# EAGLE design PhoenicianClock_d (EAGLE 7.2.0)
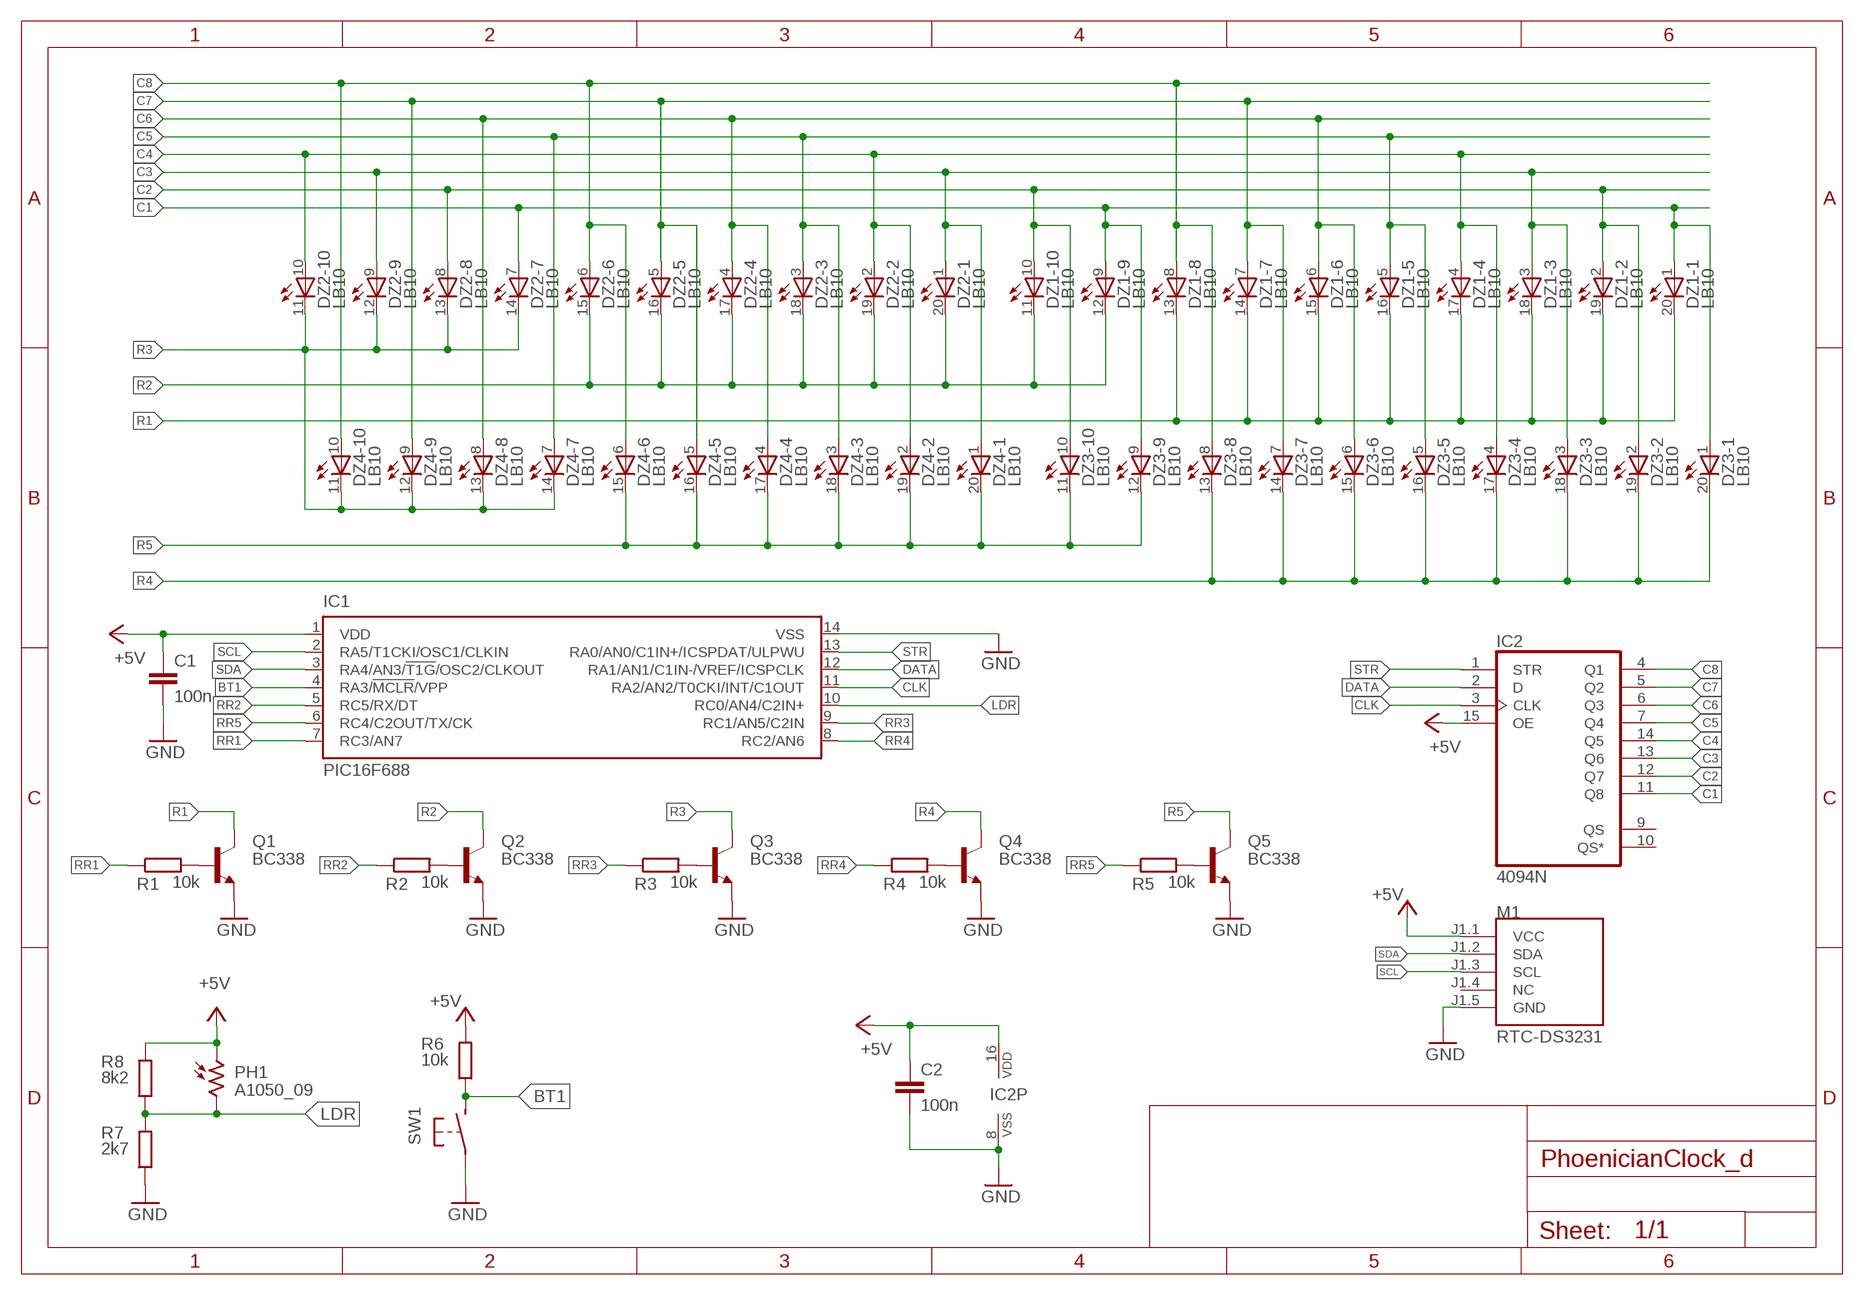
[diagram p0: schematic, sheet 1]

## Parts
C1  100n  C-EU050-024X044  [C050-024X044]
C2  100n  C-EU050-024X044  [C050-024X044]
DZ1  LB10  [LB10]
DZ2  LB10  [LB10]
DZ3  LB10  [LB10]
DZ4  LB10  [LB10]
IC1  PIC16F688  [DIL14]
IC2  4094N  [DIL16]
M1  RTC-DS3231  [RTC-DS3231_SMALL]
PH1  A1050_09  [T0-46-A10XX]
Q1  BC338  [TO92-EBC]
Q2  BC338  [TO92-EBC]
Q3  BC338  [TO92-EBC]
Q4  BC338  [TO92-EBC]
Q5  BC338  [TO92-EBC]
R1  10k  R-EU_0204/5  [0204/5]
R2  10k  R-EU_0204/5  [0204/5]
R3  10k  R-EU_0204/5  [0204/5]
R4  10k  R-EU_0204/5  [0204/5]
R5  10k  R-EU_0204/5  [0204/5]
R6  10k  R-EU_0204/5  [0204/5]
R7  2k7  R-EU_0204/5  [0204/5]
R8  8k2  R-EU_0204/5  [0204/5]
SW1  MINISPDT  [2PST_MINI]

## Nets
+5V: C1.1 C2.1 IC1.1(VDD) IC2.15(OE) IC2.16(VDD) M1.J1.1(VCC) PH1.1 R6.2 R8.2
BT1: IC1.4(RA3/!MCLR!/VPP) R6.1 SW1.P$2(S)
C1: DZ1.1(-1:A) DZ1.9(-9:A) DZ2.7(-7:A) DZ3.1(-1:A) DZ3.9(-9:A) IC2.11(Q8)
C2: DZ1.2(-2:A) DZ1.10(-10:A) DZ2.8(-8:A) DZ3.2(-2:A) DZ3.10(-10:A) IC2.12(Q7)
C3: DZ1.3(-3:A) DZ2.1(-1:A) DZ2.9(-9:A) DZ3.3(-3:A) DZ4.1(-1:A) IC2.13(Q6)
C4: DZ1.4(-4:A) DZ2.2(-2:A) DZ2.10(-10:A) DZ3.4(-4:A) DZ4.2(-2:A) IC2.14(Q5)
C5: DZ1.5(-5:A) DZ2.3(-3:A) DZ3.5(-5:A) DZ4.3(-3:A) DZ4.7(-7:A) IC2.7(Q4)
C6: DZ1.6(-6:A) DZ2.4(-4:A) DZ3.6(-6:A) DZ4.4(-4:A) DZ4.8(-8:A) IC2.6(Q3)
C7: DZ1.7(-7:A) DZ2.5(-5:A) DZ3.7(-7:A) DZ4.5(-5:A) DZ4.9(-9:A) IC2.5(Q2)
C8: DZ1.8(-8:A) DZ2.6(-6:A) DZ3.8(-8:A) DZ4.6(-6:A) DZ4.10(-10:A) IC2.4(Q1)
CLK: IC1.11(RA2/AN2/T0CKI/INT/C1OUT) IC2.3(CLK)
DATA: IC1.12(RA1/AN1/C1IN-/VREF/ICSPCLK) IC2.2(D)
GND: C1.2 C2.2 IC1.14(VSS) IC2.8(VSS) M1.J1.5(GND) Q1.E Q2.E Q3.E Q4.E Q5.E R7.1 SW1.P$1(P)
LDR: IC1.10(RC0/AN4/C2IN+) PH1.2 R7.2 R8.1
N$3: Q1.B R1.2
N$4: Q2.B R2.2
N$5: Q3.B R3.2
N$6: Q4.B R4.2
N$7: Q5.B R5.2
R1: DZ1.13(-8:C) DZ1.14(-7:C) DZ1.15(-6:C) DZ1.16(-5:C) DZ1.17(-4:C) DZ1.18(-3:C) DZ1.19(-2:C) DZ1.20(-1:C) Q1.C
R2: DZ1.11(-10:C) DZ1.12(-9:C) DZ2.15(-6:C) DZ2.16(-5:C) DZ2.17(-4:C) DZ2.18(-3:C) DZ2.19(-2:C) DZ2.20(-1:C) Q2.C
R3: DZ2.11(-10:C) DZ2.12(-9:C) DZ2.13(-8:C) DZ2.14(-7:C) DZ4.11(-10:C) DZ4.12(-9:C) DZ4.13(-8:C) DZ4.14(-7:C) Q3.C
R4: DZ3.13(-8:C) DZ3.14(-7:C) DZ3.15(-6:C) DZ3.16(-5:C) DZ3.17(-4:C) DZ3.18(-3:C) DZ3.19(-2:C) DZ3.20(-1:C) Q4.C
R5: DZ3.11(-10:C) DZ3.12(-9:C) DZ4.15(-6:C) DZ4.16(-5:C) DZ4.17(-4:C) DZ4.18(-3:C) DZ4.19(-2:C) DZ4.20(-1:C) Q5.C
RR1: IC1.7(RC3/AN7) R1.1
RR2: IC1.5(RC5/RX/DT) R2.1
RR3: IC1.9(RC1/AN5/C2IN) R3.1
RR4: IC1.8(RC2/AN6) R4.1
RR5: IC1.6(RC4/C2OUT/TX/CK) R5.1
SCL: IC1.2(RA5/T1CKI/OSC1/CLKIN) M1.J1.3(SCL)
SDA: IC1.3(RA4/AN3/!T1G!/OSC2/CLKOUT) M1.J1.2(SDA)
STR: IC1.13(RA0/AN0/C1IN+/ICSPDAT/ULPWU) IC2.1(STR)
Unconnected: IC2.9(QS) IC2.10(QS*) M1.J1.4(NC)

## Library data of the parts
C1 C2 = rcl:C-EU: CAPACITOR, European symbol
DZ1-DZ4 = led:LB10: LED BLOCK 10-LED bar graph, DIL, Siemens
IC1 = microchip:PIC16F68*
IC2 = 40xx:4094: 8-stage SHIFT/STORE REGISTER, tri-state
M1 = RTC:RTC-DS3231
PH1 = photo-elements:A10: Sensor Robust Light Sensing Applications Outdoor Light Sensing Application Source: http://optoelectronics.perkinelmer.com/content/Datasheets/DTS_PhotocellsA1050.pdf
Q1-Q5 = transistor-npn:BC338*: NPN Transistor
R1-R8 = rcl:R-EU_: RESISTOR, European symbol
SW1 = tactile:MINISPDT

## Board
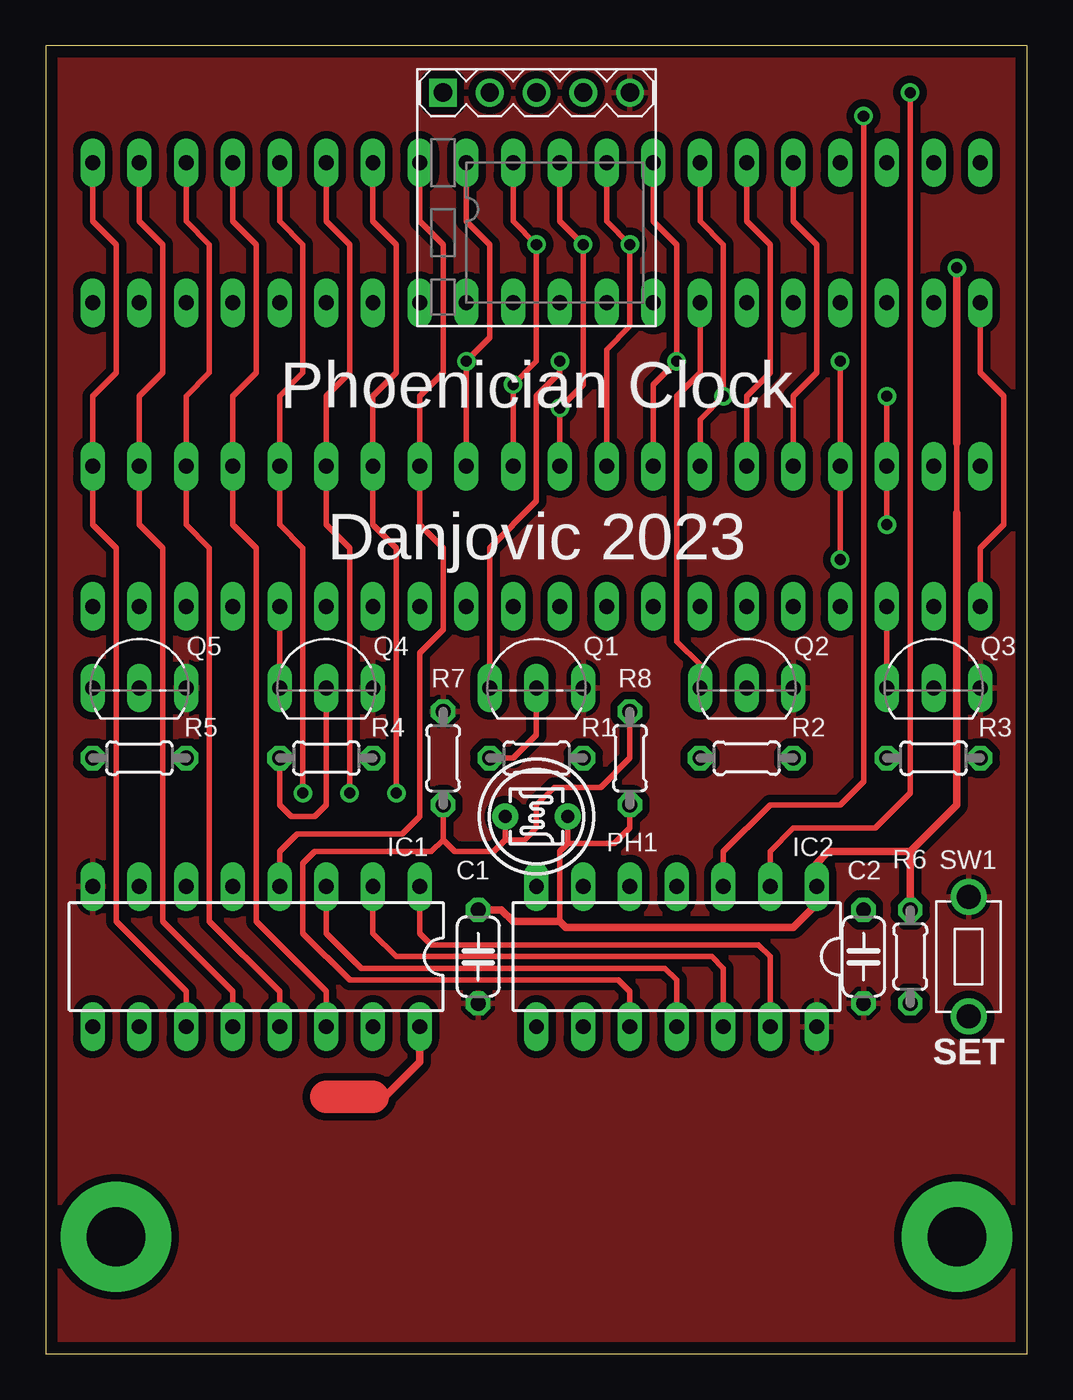
[diagram p1: board, top side]
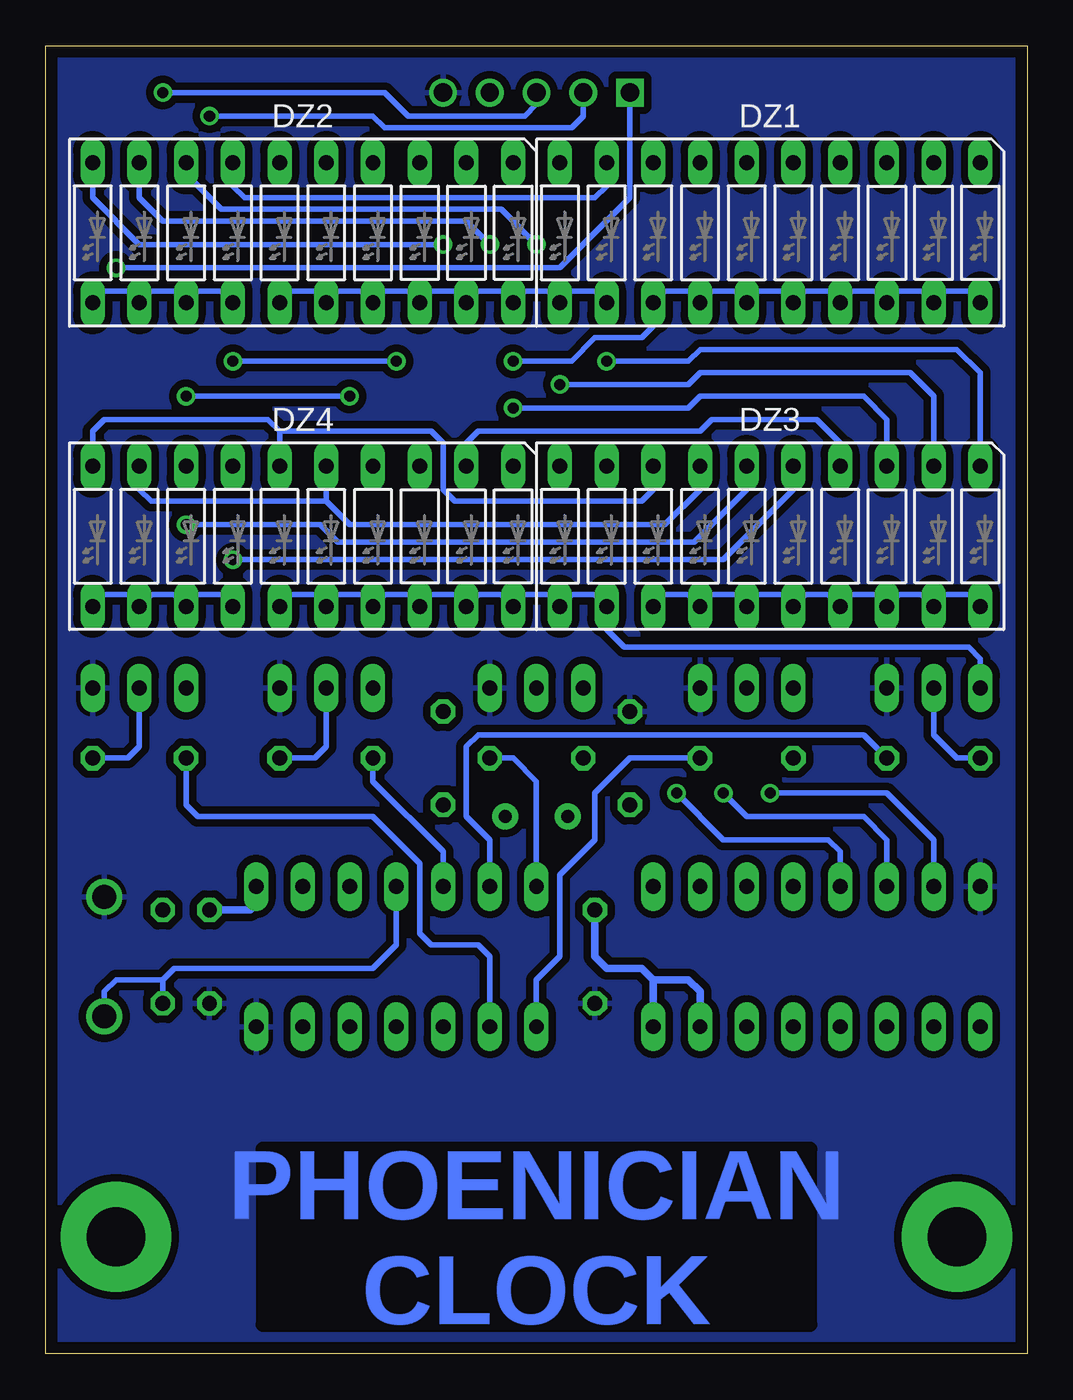
[diagram p2: board, bottom side, seen from below]

Size 53.34 x 71.12 mm. Coordinates in mm from the lower left corner, seen from the top.
Outline: 0,0 53.34,0 53.34,71.12 0,71.12 0,0
Copper layers (1*16): Top 0.035mm / dielectric 1.5mm / Bottom 0.035mm
Design rules "default *": minimum track width 10mil, minimum drill 24mil, track to track 8mil, track to pad 8mil, pad to pad 8mil, via to via 8mil, smd to smd 8mil, copper to edge 25mil, drill to drill 8mil, minimum pad ring 10mil, minimum via ring 8mil, stop-mask expansion 4mil, vias tented up to drill 27mil, thermal gap 10mil

### Footprints (pad centres in the part's own frame; a part is rotated, then mirrored left to right if it is on the bottom)
C050-024X044 = drill 0.813 octagon: 1 -2.54,0; 2 2.54,0
LB10 = drill 0.813 long: 1 -11.43,-3.81; 2 -8.89,-3.81; 3 -6.35,-3.81; 4 -3.81,-3.81; 5 -1.27,-3.81; 6 1.27,-3.81; 7 3.81,-3.81; 8 6.35,-3.81; 9 8.89,-3.81; 10 11.43,-3.81; 11 11.43,3.81; 12 8.89,3.81; 13 6.35,3.81; 14 3.81,3.81; 15 1.27,3.81; 16 -1.27,3.81; 17 -3.81,3.81; 18 -6.35,3.81; 19 -8.89,3.81; 20 -11.43,3.81
DIL14 = drill 0.813 long: 1 -7.62,-3.81; 2 -5.08,-3.81; 3 -2.54,-3.81; 4 0,-3.81; 5 2.54,-3.81; 6 5.08,-3.81; 7 7.62,-3.81; 8 7.62,3.81; 9 5.08,3.81; 10 2.54,3.81; 11 0,3.81; 12 -2.54,3.81; 13 -5.08,3.81; 14 -7.62,3.81
DIL16 = drill 0.813 long: 1 -8.89,-3.81; 2 -6.35,-3.81; 3 -3.81,-3.81; 4 -1.27,-3.81; 5 1.27,-3.81; 6 3.81,-3.81; 7 6.35,-3.81; 8 8.89,-3.81; 9 8.89,3.81; 10 6.35,3.81; 11 3.81,3.81; 12 1.27,3.81; 13 -1.27,3.81; 14 -3.81,3.81; 15 -6.35,3.81; 16 -8.89,3.81
RTC-DS3231_SMALL = drill 1 square: J1.1 -5.08,6.35 | drill 1: J1.2 -2.54,6.35; J1.3 0,6.35; J1.4 2.54,6.35; J1.5 5.08,6.35
T0-46-A10XX = drill 0.7 pad 1.4: 1 -1.7,0; 2 1.7,0
TO92-EBC = drill 0.813 long: B 0,-1.27; C -2.54,-1.27; E 2.54,-1.27
0204/5 = drill 0.813 octagon: 1 -2.54,0; 2 2.54,0
2PST_MINI = drill 1.3: P$1 0,3.25; P$2 0,-3.25

### Placement (x,y rotation side)
C1  23.5,21.59 270 top
C2  44.45,21.59 270 top
DZ1  13.97,60.96 180 bottom
DZ2  39.37,60.96 180 bottom
DZ3  13.97,44.45 180 bottom
DZ4  39.37,44.45 180 bottom
IC1  34.29,21.59 180 top
IC2  11.43,21.59 180 top
M1  26.67,62.23 0 top
PH1  26.67,29.21 180 top
Q1  26.67,37.47 0 top
Q2  38.1,37.47 0 top
Q3  48.26,37.47 0 top
Q4  15.24,37.47 0 top
Q5  5.08,37.47 0 top
R1  26.67,32.38 180 top
R2  38.1,32.38 0 top
R3  48.26,32.38 0 top
R4  15.24,32.38 180 top
R5  5.08,32.38 180 top
R6  46.99,21.59 90 top
R7  21.59,32.38 270 top
R8  31.75,32.38 270 top
SW1  50.16,21.59 0 top

### Tracks (layer width: path | path; a pad name or v marks a point on that pad's centre or on a via)
+5V  (via drill 0.6)
  Top 0.305: 49.53,45.72 49.53,49.53 | PH1.1 28.37,27.73 | 28.37,27.73 27.94,27.3 27.94,23.5 | R8.2 31.75,28.57 30.91,27.73 28.37,27.73
  Top 0.406: C1.1 24.77,24.13 25.4,23.5 27.94,23.5 28.26,23.18 40.64,23.18 41.91,24.45 IC1.1 41.91,26.67 42.55,27.3 46.99,27.3 | IC2.16 20.32,15.88 18.41,13.97 17.78,13.97 | 46.99,27.3 49.53,29.84 49.53,45.72 | R6.2 46.99,27.3 | 49.53,49.53 v49.53,59.05
  Top 1.778: 17.78,13.97 15.24,13.97
  Bottom 0.305: M1.J1.1 21.59,62.87 25.4,59.05 v49.53,59.05
  Bottom 0.406: C2.1 42.23,24.13 41.91,24.45 IC1.1 | C1.1 23.5,21.59 22.86,20.95 20.95,20.95 20.32,20.32 | 20.32,20.32 IC2.16 | IC2.15 17.78,19.68 18.41,20.32 20.32,20.32
BT1
  Bottom 0.305: IC1.4 34.29,22.23 35.56,20.95 46.35,20.95 46.99,20.32 | 46.99,20.32 49.53,20.32 50.16,19.68 SW1.P$2 | R6.1 46.99,20.32
C1  (via drill 0.6)
  Top 0.305: DZ1.1 2.54,61.59 3.81,60.33 3.81,53.34 2.54,52.07 DZ3.1 2.54,45.09 3.81,43.81 3.81,23.5 7.62,19.68 IC2.11 | DZ3.9 v22.86,53.98 24.13,55.24 24.13,60.33 22.86,61.59 DZ1.9
  Bottom 0.305: v22.86,53.98 18.41,53.98 17.78,54.61 3.81,54.61 2.54,53.34 DZ3.1 | DZ2.7 43.18,63.5 42.55,62.87 23.5,62.87 22.86,63.5 DZ1.9
C2  (via drill 0.6)
  Top 0.305: DZ1.2 5.08,61.59 6.35,60.33 6.35,53.34 5.08,52.07 DZ3.2 5.08,45.09 6.35,43.81 6.35,23.5 10.16,19.68 IC2.12 | DZ1.10 25.4,61.59 v26.67,60.33 26.67,53.98 v25.4,52.7 DZ3.10
  Bottom 0.305: v25.4,52.7 18.41,52.7 17.78,53.34 6.35,53.34 5.08,52.07 DZ3.2 | v26.67,60.33 28.57,62.23 43.81,62.23 45.72,64.14 DZ2.8
C3  (via drill 0.6)
  Top 0.305: DZ1.3 7.62,61.59 8.89,60.33 8.89,53.34 7.62,52.07 DZ3.3 7.62,45.09 8.89,43.81 8.89,23.5 12.7,19.68 IC2.13 | DZ4.1 v27.94,51.44 29.21,52.7 v29.21,60.33 27.94,61.59 DZ2.1
  Bottom 0.305: v27.94,51.44 18.41,51.44 17.78,52.07 8.89,52.07 7.62,50.8 DZ3.3 | v29.21,60.33 30.48,61.59 46.99,61.59 48.26,62.87 DZ2.9
C4  (via drill 0.6)
  Top 0.305: DZ1.4 10.16,61.59 11.43,60.33 11.43,53.34 10.16,52.07 DZ3.4 10.16,45.09 11.43,43.81 11.43,23.5 15.24,19.68 IC2.14 | DZ4.2 30.48,54.61 31.75,55.88 v31.75,60.33 30.48,61.59 DZ2.2
  Bottom 0.305: v31.75,60.33 48.26,60.33 50.8,62.87 DZ2.10 | DZ4.2 30.48,49.53 29.84,50.16 17.78,50.16 17.14,50.8 11.43,50.8 10.16,49.53 DZ3.4
C5  (via drill 0.6)
  Top 0.305: DZ1.5 12.7,61.59 13.97,60.33 13.97,53.34 12.7,52.07 DZ3.5 12.7,45.09 13.97,43.81 v13.97,30.48 | DZ4.3 33.02,52.7 v34.29,53.98 34.29,60.33 33.02,61.59 DZ2.3 | v43.18,43.18 DZ4.7 v43.18,53.98
  Bottom 0.305: v43.18,43.18 16.51,43.18 12.7,46.99 DZ3.5 | v34.29,53.98 v43.18,53.98 | v13.97,30.48 7.62,30.48 5.08,27.94 IC2.7
C6  (via drill 0.6)
  Top 0.305: DZ1.6 15.24,61.59 16.51,60.33 16.51,53.34 15.24,52.07 DZ3.6 15.24,45.09 16.51,43.81 v16.51,30.48 | DZ4.4 35.56,50.8 v36.83,52.07 36.83,60.33 35.56,61.59 DZ2.4 | v45.72,45.09 DZ4.8 v45.72,52.07
  Bottom 0.305: v16.51,30.48 15.24,29.21 8.89,29.21 7.62,27.94 IC2.6 | v45.72,45.09 38.42,45.09 37.47,44.13 18.1,44.13 15.24,46.99 DZ3.6 | v36.83,52.07 v45.72,52.07
C7  (via drill 0.6)
  Top 0.305: DZ1.7 17.78,61.59 19.05,60.33 19.05,53.34 17.78,52.07 DZ3.7 17.78,45.09 19.05,43.81 v19.05,30.48 | DZ4.5 38.1,52.07 39.37,53.34 39.37,60.33 38.1,61.59 DZ2.5
  Bottom 0.305: v19.05,30.48 16.51,27.94 10.79,27.94 10.16,27.3 IC2.5 | 38.1,46.35 47.62,46.35 48.26,46.99 DZ4.9 | 38.1,46.35 36.83,45.09 19.68,45.09 17.78,46.99 DZ3.7 | DZ4.5 38.1,46.35
C8
  Top 0.305: DZ1.8 20.32,61.59 21.59,60.33 21.59,53.34 20.32,52.07 DZ3.8 20.32,45.09 21.59,43.81 21.59,39.37 20.32,38.1 20.32,29.21 19.37,28.26 13.65,28.26 12.7,27.3 IC2.4 | DZ4.6 40.64,52.07 41.91,53.34 41.91,60.33 40.64,61.59 DZ2.6
  Bottom 0.305: DZ4.10 50.8,50.16 50.16,50.8 41.27,50.8 40.64,50.16 | 40.64,50.16 32.38,50.16 31.75,49.53 31.75,46.99 31.11,46.35 20.95,46.35 20.32,46.99 DZ3.8 | 40.64,50.16 DZ4.6
CLK
  Top 0.305: IC2.3 15.24,22.86 17.14,20.95 33.66,20.95 34.29,20.32 IC1.11
DATA
  Top 0.305: IC2.2 17.78,22.86 19.05,21.59 36.2,21.59 36.83,20.95 IC1.12
GND
  pour Bottom (isolate 0.406): 0,0 0,71.12 53.34,71.12 53.34,0
  pour Top (isolate 0.406): 0,71.12 0,0 53.34,0 53.34,71.12
LDR
  Top 0.305: IC1.10 31.75,19.68 31.11,20.32 16.51,20.32 13.97,22.86 13.97,26.67 14.61,27.3 20.95,27.3 21.59,27.94 | R8.1 31.75,32.38 30.16,30.8 27.62,30.8 26.67,29.84 26.67,28.57 26.04,27.94 24.97,27.94 | 21.59,27.94 22.23,27.3 24.34,27.3 24.97,27.94 | 24.97,27.94 PH1.2 | R7.2 21.59,27.94
N$1  (via drill 3.2 pad 6)
  other vias: 3.81,6.35
N$2  (via drill 3.2 pad 6)
  other vias: 49.53,6.35
N$3
  Top 0.305: R1.2 25.4,32.38 26.67,33.66 Q1.B
N$4
  Bottom 0.305: Q2.B 38.1,33.02 38.73,32.38 R2.2
N$5
  Bottom 0.305: Q3.B 48.26,33.02 48.9,32.38 R3.2
N$6
  Top 0.305: R4.2 12.7,29.84 13.34,29.21 14.61,29.21 15.24,29.84 Q4.B
N$7
  Bottom 0.305: R5.2 3.81,32.38 5.08,33.66 Q5.B
R1  (via drill 0.6)
  Top 0.305: v27.94,53.98 27.94,53.34 26.67,52.07 26.67,46.35 24.13,43.81 Q1.C
  Bottom 0.305: DZ1.20 3.17,57.78 4.45,57.78 DZ1.19 5.71,57.78 6.99,57.78 DZ1.18 8.26,57.78 9.53,57.78 DZ1.17 10.79,57.78 12.06,57.78 DZ1.16 13.34,57.78 14.61,57.78 DZ1.15 15.88,57.78 17.14,57.78 DZ1.14 18.41,57.78 19.68,57.78 DZ1.13 20.32,55.88 20.95,55.24 23.5,55.24 24.77,53.98 v27.94,53.98
R2
  Top 0.305: Q2.C 35.56,37.47 34.29,38.73 34.29,52.07 35.56,53.34 DZ2.17
  Bottom 0.305: DZ1.12 23.5,57.78 24.77,57.78 DZ1.11 26.04,57.78 27.3,57.78 DZ2.20 28.57,57.78 29.84,57.78 DZ2.19 31.11,57.78 32.38,57.78 DZ2.18 33.66,57.78 34.92,57.78 DZ2.17 36.2,57.78 37.47,57.78 DZ2.16 38.73,57.78 40.01,57.78 DZ2.15
R3
  Top 0.305: DZ4.11 50.8,43.81 52.07,45.09 52.07,52.07 50.8,53.34 DZ2.11 | Q3.C DZ4.13
  Bottom 0.305: DZ2.11 50.16,57.78 48.9,57.78 DZ2.12 47.62,57.78 46.35,57.78 DZ2.13 45.09,57.78 43.81,57.78 DZ2.14 | DZ4.14 43.81,41.27 45.09,41.27 DZ4.13 46.35,41.27 47.62,41.27 DZ4.12 48.9,41.27 50.16,41.27 DZ4.11
R4
  Top 0.305: Q4.C DZ3.16
  Bottom 0.305: DZ3.20 3.17,41.27 4.45,41.27 DZ3.19 5.71,41.27 6.99,41.27 DZ3.18 8.26,41.27 9.53,41.27 DZ3.17 10.79,41.27 12.06,41.27 DZ3.16 13.34,41.27 14.61,41.27 DZ3.15 15.88,41.27 17.14,41.27 DZ3.14 18.41,41.27 19.68,41.27 DZ3.13
R5
  Bottom 0.305: DZ4.15 40.01,41.27 38.73,41.27 DZ4.16 37.47,41.27 36.2,41.27 DZ4.17 34.92,41.27 33.66,41.27 DZ4.18 32.38,41.27 31.11,41.27 DZ4.19 29.84,41.27 28.57,41.27 DZ4.20 27.3,41.27 26.04,41.27 DZ3.11 24.77,41.27 23.5,41.27 DZ3.12 22.86,39.37 21.91,38.42 3.17,38.42 2.54,37.78 Q5.C
RR1
  Bottom 0.305: R1.1 27.94,32.38 26.67,31.11 IC1.7
RR2
  Bottom 0.305: IC1.5 31.75,27.3 35.56,31.11 R2.1
RR3
  Bottom 0.305: R3.1 45.72,29.84 45.09,29.21 35.56,29.21 33.02,26.67 33.02,22.86 32.38,22.23 29.84,22.23 29.21,21.59 IC1.9
RR4
  Bottom 0.305: R4.1 21.59,32.38 23.5,30.48 23.5,27.94 25.4,26.04 25.4,21.59 26.67,20.32 IC1.8
RR5
  Bottom 0.305: IC1.6 29.21,27.94 30.48,29.21 30.48,33.02 29.84,33.66 8.89,33.66 R5.1
SCL  (via drill 0.6)
  Top 0.305: v46.99,68.58 46.99,30.48 45.09,28.57 40.64,28.57 39.37,27.3 IC1.2
  Bottom 0.305: M1.J1.3 26.67,67.94 27.3,67.31 33.66,67.31 34.92,68.58 v46.99,68.58
SDA  (via drill 0.6)
  Top 0.305: v44.45,67.31 44.45,31.11 43.18,29.84 39.37,29.84 36.83,27.3 IC1.3
  Bottom 0.305: M1.J1.2 24.13,67.31 24.77,66.67 34.92,66.67 35.56,67.31 v44.45,67.31
STR
  Top 0.305: IC2.1 20.32,22.86 20.95,22.23 25.4,22.23 38.73,22.23 39.37,21.59 IC1.13

### Text on the board
Bottom: PHOENICIAN / CLOCK
tPlace: Phoenician Clock | Danjovic 2023 | SET
tStop: +5V | GND
bStop: PHOENICIAN / CLOCK